# Altium project mini4axis.PrjPcb
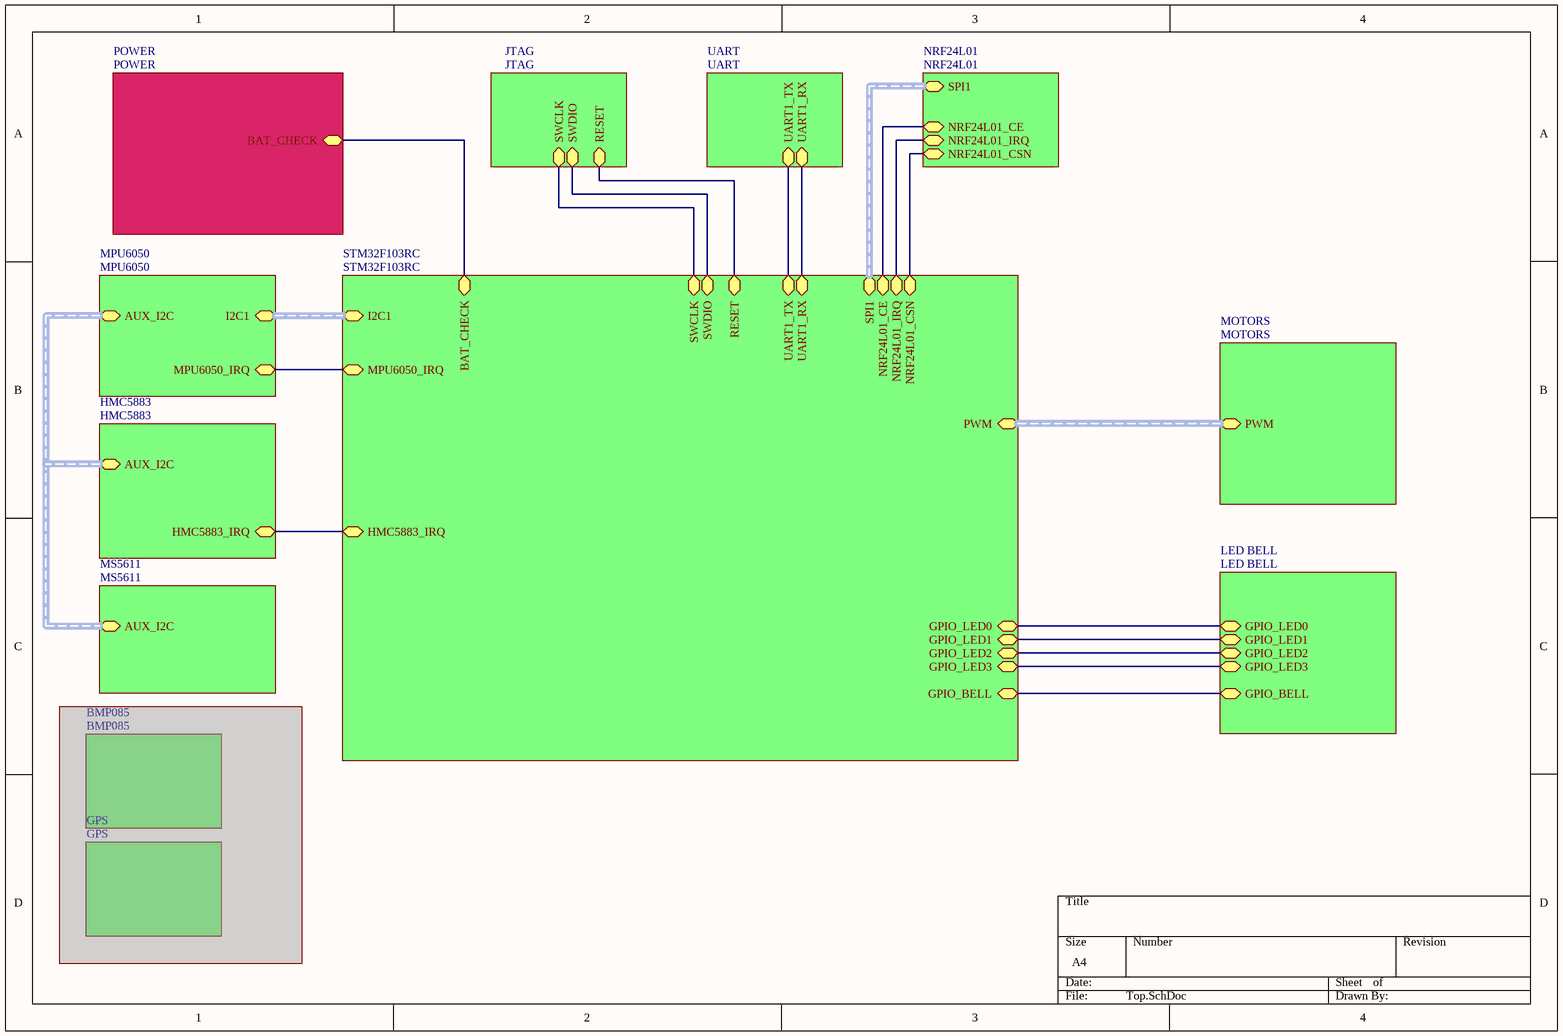
[diagram p0: Top.SchDoc]
11 sheets, 100 parts. Net scope: hierarchical (ports join the sheet entries above them; power ports are global).
Board file: PCB4.PcbDoc
Sheets:
  Top.SchDoc
    POWER = POWER.SchDoc
    JTAG = JTAG.SchDoc
    UART = UART.SchDoc
    NRF24L01 = NRF24L01.SchDoc
    MOTORS = MOTORS.SchDoc
    LED BELL = LED BELL.SchDoc
    MPU6050 = MPU6050.SchDoc
    STM32F103RC = STM32F103RC.SchDoc
    HMC5883 = HMC5883.SchDoc
    MS5611 = MS5611.SchDoc

## Sheet Top.SchDoc: TRACE TRACK
size A4; Author: YZ

### Sub-sheets
BMP085 = BMP085 (masked out) (file not in this document): no entries
GPS = GPS (masked out) (file not in this document): no entries
HMC5883 = HMC5883: AUX_I2C (harness AUX_I2C), HMC5883_IRQ
JTAG = JTAG: SWCLK, SWDIO, RESET
LED BELL = LED BELL: GPIO_LED1, GPIO_LED0, GPIO_BELL, GPIO_LED3, GPIO_LED2
MOTORS = MOTORS: PWM (harness PWM)
MPU6050 = MPU6050: MPU6050_IRQ, I2C1 (harness I2C1), AUX_I2C (harness AUX_I2C)
MS5611 = MS5611: AUX_I2C (harness AUX_I2C)
NRF24L01 = NRF24L01: SPI1 (harness SPI1), NRF24L01_IRQ, NRF24L01_CSN, NRF24L01_CE
POWER = POWER: BAT_CHECK
STM32F103RC = STM32F103RC: UART1_TX, UART1_RX, SWCLK, RESET, SWDIO, GPIO_BELL, GPIO_LED0, GPIO_LED1, PWM (harness PWM), NRF24L01_IRQ, NRF24L01_CSN, SPI1 (harness SPI1), NRF24L01_CE, I2C1 (harness I2C1), MPU6050_IRQ, HMC5883_IRQ, BAT_CHECK, GPIO_LED2, GPIO_LED3
UART = UART: UART1_TX, UART1_RX

### Nets
BAT_CHECK: sheet POWER/BAT_CHECK, sheet STM32F103RC/BAT_CHECK
GPIO_BELL: sheet LED BELL/GPIO_BELL, sheet STM32F103RC/GPIO_BELL
GPIO_LED0: sheet LED BELL/GPIO_LED0, sheet STM32F103RC/GPIO_LED0
GPIO_LED1: sheet LED BELL/GPIO_LED1, sheet STM32F103RC/GPIO_LED1
GPIO_LED2: sheet LED BELL/GPIO_LED2, sheet STM32F103RC/GPIO_LED2
GPIO_LED3: sheet LED BELL/GPIO_LED3, sheet STM32F103RC/GPIO_LED3
HMC5883_IRQ: sheet STM32F103RC/HMC5883_IRQ, sheet HMC5883/HMC5883_IRQ
MPU6050_IRQ: sheet MPU6050/MPU6050_IRQ, sheet STM32F103RC/MPU6050_IRQ
NRF24L01_CE: sheet NRF24L01/NRF24L01_CE, sheet STM32F103RC/NRF24L01_CE
NRF24L01_CSN: sheet NRF24L01/NRF24L01_CSN, sheet STM32F103RC/NRF24L01_CSN
NRF24L01_IRQ: sheet NRF24L01/NRF24L01_IRQ, sheet STM32F103RC/NRF24L01_IRQ
RESET: sheet JTAG/RESET, sheet STM32F103RC/RESET
SWCLK: sheet JTAG/SWCLK, sheet STM32F103RC/SWCLK
SWDIO: sheet JTAG/SWDIO, sheet STM32F103RC/SWDIO
UART1_RX: sheet UART/UART1_RX, sheet STM32F103RC/UART1_RX
UART1_TX: sheet UART/UART1_TX, sheet STM32F103RC/UART1_TX

### Buses and harness runs
harness sheet HMC5883/AUX_I2C = sheet MPU6050/AUX_I2C = sheet MS5611/AUX_I2C
harness sheet MOTORS/PWM = sheet STM32F103RC/PWM
harness sheet MPU6050/I2C1 = sheet STM32F103RC/I2C1
harness sheet NRF24L01/SPI1 = sheet STM32F103RC/SPI1

## Sheet POWER.SchDoc
size A4
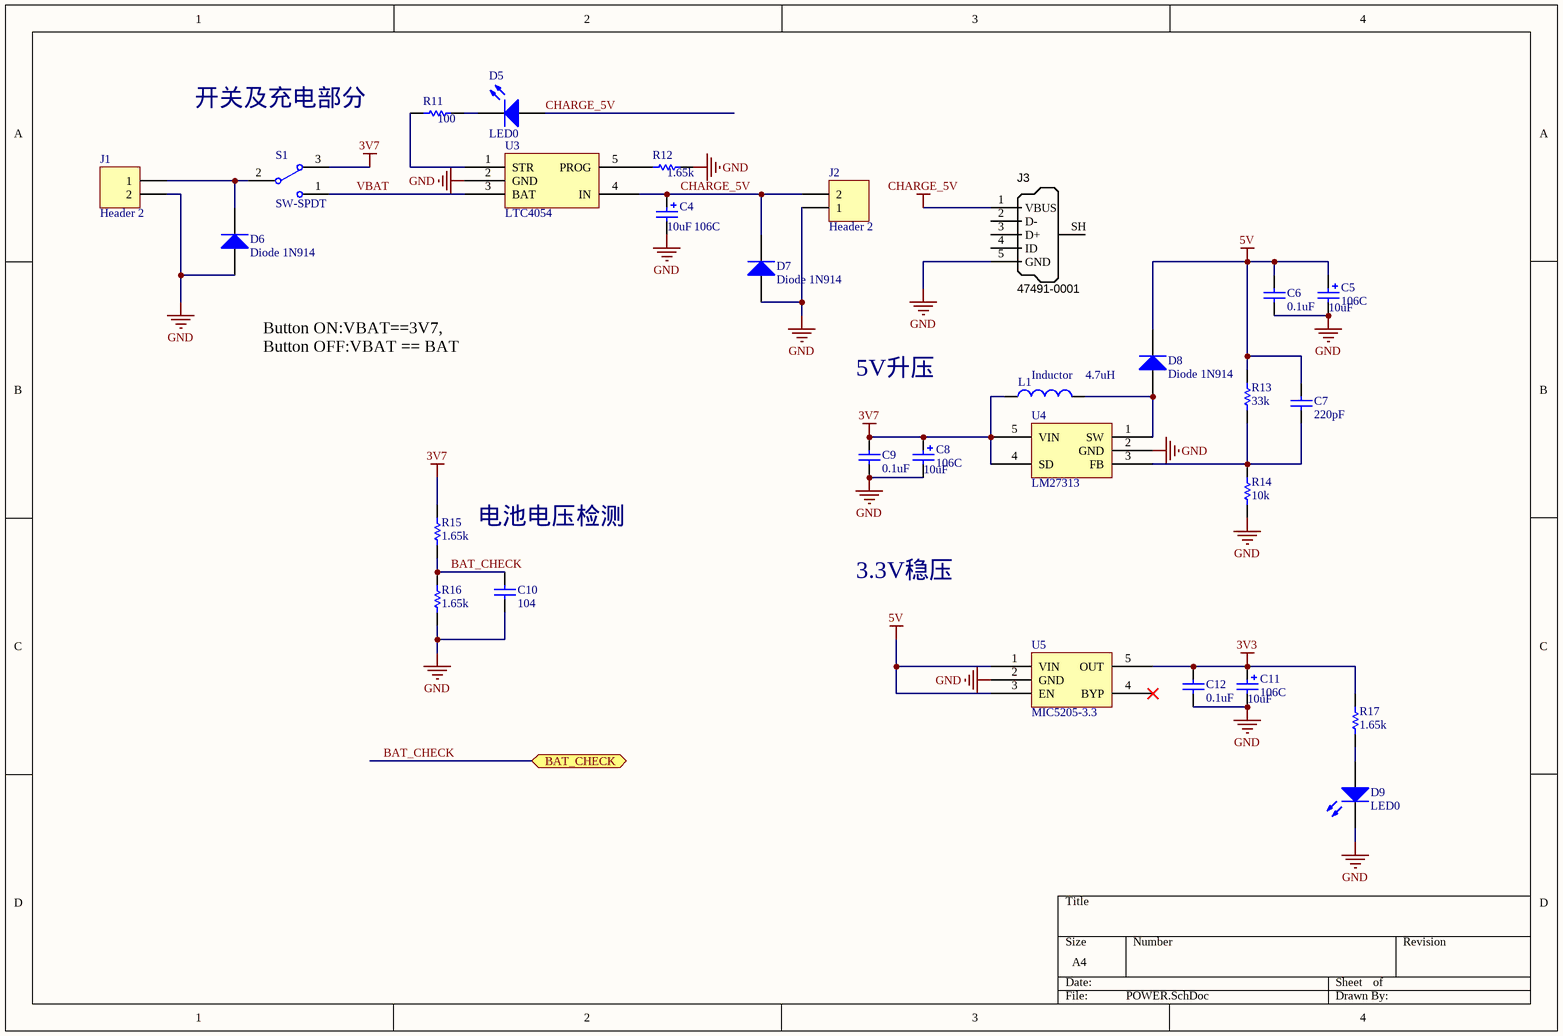
[diagram p1: POWER.SchDoc]

### Parts
(Parts that share a designator on the sheet are numbered #1, #2 ... from top to bottom, then left to right.)
C4  106C  value 10uF  [CAP_TAN_A1206]
C5  106C  value 10uF  [CAP_TAN_A1206]
C6  value 0.1uF  [CAP_0603]  (hidden comment: Cap)
C7  value 220pF  [CAP_0603]  (hidden comment: Cap)
C8  106C  value 10uF  [CAP_TAN_A1206]
C9#1  value 0.1uF  [CAP_0603]  (hidden comment: Cap)
C10#1  value 104  [CAP_0603]  (hidden comment: Cap)
C11#1  106C  value 10uF  [CAP_TAN_A1206]
C12  value 0.1uF  [CAP_0603]  (hidden comment: Cap)
D5  LED0  [LED_0603_RED]
D6  Diode 1N914  [SS14]
D7  Diode 1N914  [SS14]
D8  Diode 1N914  [SS14]
D9  LED0  [LED_0603_RED]
J1  Header 2  [HDR1X2]
J2  Header 2  [HDR1X2]
J3  Manufacturer Part Number 1: 47491-0001  [USB_MICRO_B]  (hidden comment: USB Micro Type B)
L1  Inductor  value 4.7uH  [IND_0805]
R11  value 100  [RES_0603]  (hidden comment: Res Semi)
R12  value 1.65k  [RES_0603]  (hidden comment: Res Semi)
R13  value 33k  [RES_0603]  (hidden comment: Res Semi)
R14  value 10k  [RES_0603]  (hidden comment: Res Semi)
R15  value 1.65k  [RES_0603]  (hidden comment: Res Semi)
R16  value 1.65k  [RES_0603]  (hidden comment: Res Semi)
R17  value 1.65k  [RES_0603]  (hidden comment: Res Semi)
S1  SW-SPDT  [SW_SPDT1X3_180_xx]
U3#1  LTC4054  [SOT23-5]
U4  LM27313  [SOT23-5]
U5  MIC5205-3.3  [SOT23-5]

### Ports
BAT_CHECK

### Nets
3V3: C11#1.1 C12.2 R17.2 U5.5(OUT)
3V7: C8.1 C9#1.2 L1.1 R15.2 S1.3 U4.4(SD) U4.5(VIN)
5V: C5.1 C6.2 C7.2 D8.2(K) R13.2 U5.1(VIN) U5.3(EN)
CHARGE_5V: C4.1 D5.1(A) D7.2(K) J2.2 J3.1(VBUS) U3#1.4(IN)
GND: C4.2 C5.2 C6.1 C8.2 C9#1.1 C10#1.1 C11#1.2 C12.1 D6.1(A) D7.1(A) D9.2(K) J1.2 J2.1 J3.5(GND) R12.2 R14.1 R16.1 U3#1.2(GND) U4.2(GND) U5.2(GND)
BAT_CHECK: C10#1.2 R15.1 R16.2 ; port BAT_CHECK
VBAT: S1.1 U3#1.3(BAT)
NetC7_1: C7.1 R13.1 R14.2 U4.3(FB)
NetD5_2: D5.2(K) R11.2
NetD6_2: D6.2(K) J1.1 S1.2
NetD8_1: D8.1(A) L1.2 U4.1(SW)
NetD9_1: D9.1(A) R17.1
NetR11_1: R11.1 U3#1.1(STR)
NetR12_1: R12.1 U3#1.5(PROG)

Not connected (* = marked no-connect by the designer): J3 2(D-) 3(D+) 4(ID) SH(Shell); U5 4(BYP)*

### Notes on the sheet
- 开关及充电部分
- Button ON:VBAT==3V7,
  Button OFF:VBAT == BAT
- 5V升压
- 电池电压检测
- 3.3V稳压

### Library data of the parts
C4 C5 C8 C11#1 = Cap Pol2: Polarized Capacitor (Axial); Published: 8-Jun-2000; LatestRevisionDate: 17-Jul-2002; LatestRevisionNote: Re-released for DXP Platform.; PackageReference: POLAR0.8; Publisher: Altium Limited; PackageDescription: Polarized Capacitor; 2 Leads
C6 C7 C9#1 C10#1 C12 = Cap: Capacitor; Published: 8-Jun-2000; LatestRevisionDate: 17-Jul-2002; LatestRevisionNote: Re-released for DXP Platform.; PackageReference: RAD-0.3; Publisher: Altium Limited; PackageDescription: Radial Cap, Thru-Hole; 2 Leads; 0.3 in Pin Spacing
D5 D9 = LED0: Typical INFRARED GaAs LED; Published: 8-Jun-2000; LatestRevisionDate: 08-Jul-2005; LatestRevisionNote: Mech Layer 1 removed.; PackageReference: LED-0; Publisher: Altium Limited; PackageDescription: LED; 2 Leads
D6-D8 = Diode 1N914: High Conductance Fast Diode; Published: 8-Jun-2000; LatestRevisionDate: 17-Jul-2002; LatestRevisionNote: Re-released for DXP Platform.; DatasheetVersion: 1997; PackageReference: DO-35; Publisher: Altium Limited; PackageDescription: Diode, Axial; Body 3.8 x 1.9 mm (LxDia. max), Lead Dia. 0.53 mm (max); Code_JEDEC: DO-204-AH; ComponentLink1Description: Manufacturer Link; ComponentLink1URL: http://www.fairchildsemi.com/; ComponentLink2Description: Datasheet; ComponentLink2URL: http://www.fairchildsemi.com/ds/1N%2F1N4448.pdf
J1 J2 = Header 2: Header, 2-Pin; LatestRevisionDate: 17-Jul-2002; LatestRevisionNote: Re-released for DXP Platform.; Publisher: Altium Limited
J3 = USB_Micro_TypeB: Connector SMD USB Micro Type B middle mount; Manufacturer 1: Molex Inc; Package / Case: SMD; Supplier 1: Digi-Key; Supplier Part Number 1: WM17142CT-ND
L1 = Inductor: Code_IEC: 1005; Published: 8-Jun-2000; LatestRevisionDate: 29-May-2009; LatestRevisionNote: IPC-7351 Footprint Added.; PackageReference: 0402-A; Publisher: Altium Limited; PackageDescription: Chip Inductor; Code_JEITA: 0402
R11-R17 = Res Semi: Semiconductor Resistor; Published: 8-Jun-2000; LatestRevisionDate: 17-Jul-2002; LatestRevisionNote: Re-released for DXP Platform.; PackageReference: AXIAL-0.5; Publisher: Altium Limited; PackageDescription: Axial Device, Thru-Hole; 2 Leads; 0.5 in Pin Spacing
S1 = SW-SPDT: SPDT Subminiature Toggle Switch, Right Angle Mounting, Vertical Actuation; Published: 24-Mar-1999; LatestRevisionDate: 17-Dec-2003; LatestRevisionNote: Schematic revised, PCB Footprint replaced.; DatasheetVersion: 05-Dec-2000; PackageReference: TL36WW15050; Publisher: Altium Limited; PackageDescription: Switch; 4 Leads; ComponentLink1Description: Manufacturer Link; ComponentLink1URL: http://www.apem.com

## Sheet JTAG.SchDoc
size A4
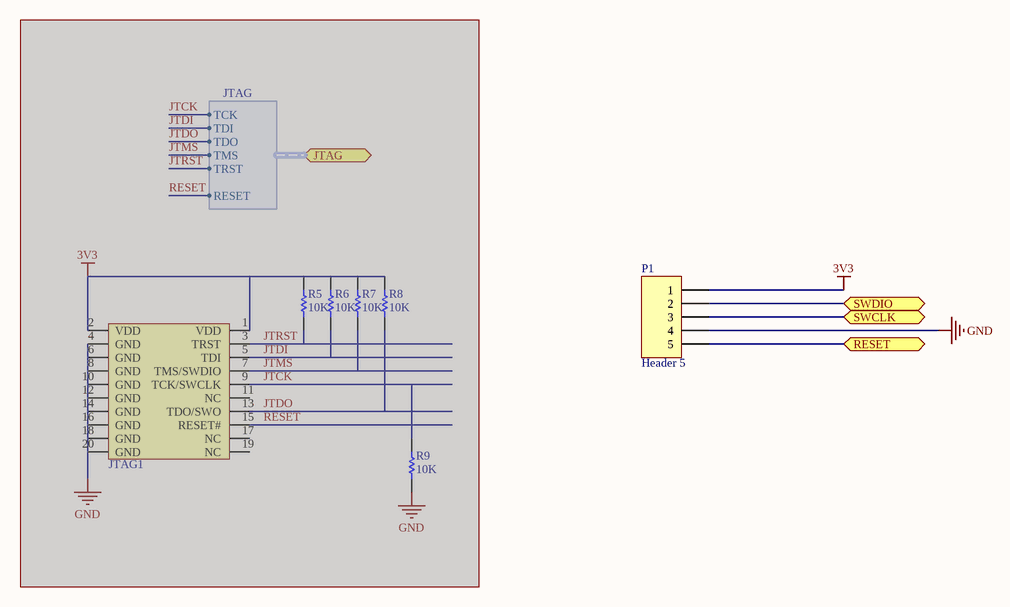
[diagram p2: JTAG.SchDoc]

### Parts
(Parts that share a designator on the sheet are numbered #1, #2 ... from top to bottom, then left to right.)
JTAG1  JTAG  [JTAG_20]  (value not drawn)  (masked out: inside a compile mask, not in the netlist)
P1  Header 5  [HDR1X5]
R5#1  value 10K  [RES_0603]  (hidden comment: Res1)  (masked out: inside a compile mask, not in the netlist)
R6#1  value 10K  [RES_0603]  (hidden comment: Res1)  (masked out: inside a compile mask, not in the netlist)
R7#1  value 10K  [RES_0603]  (hidden comment: Res1)  (masked out: inside a compile mask, not in the netlist)
R8#1  value 10K  [RES_0603]  (hidden comment: Res1)  (masked out: inside a compile mask, not in the netlist)
R9#1  value 10K  [RES_0603]  (hidden comment: Res1)  (masked out: inside a compile mask, not in the netlist)

### Ports
JTAG (harness JTAG), RESET, SWCLK, SWDIO

### Harnesses
JTAG: TCK, TDI, TDO, TMS, TRST, RESET

### Nets
3V3: P1.1
GND: P1.4
RESET: P1.5 ; port RESET
SWCLK: P1.3 ; port SWCLK
SWDIO: P1.2 ; port SWDIO

### Library data of the parts
P1 = Header 5: Header, 5-Pin; LatestRevisionDate: 17-Jul-2002; LatestRevisionNote: Re-released for DXP Platform.; Publisher: Altium Limited
R5#1 R6#1 R7#1 R8#1 R9#1 = Res1: Resistor; Published: 8-Jun-2000; LatestRevisionDate: 17-Jul-2002; LatestRevisionNote: Re-released for DXP Platform.; PackageReference: AXIAL-0.3; Publisher: Altium Limited; PackageDescription: Axial Device, Thru-Hole; 2 Leads; 0.3 in Pin Spacing

## Sheet UART.SchDoc
size A4
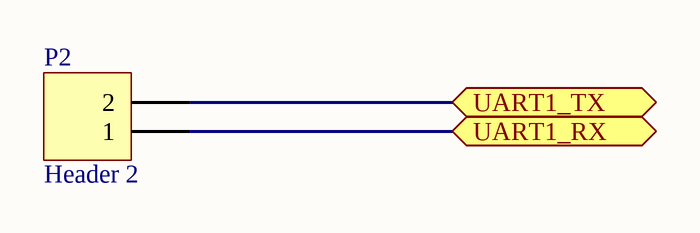
[diagram p3: UART.SchDoc]

### Parts
P2  Header 2  [HDR1X2]

### Ports
UART1_RX, UART1_TX

### Nets
UART1_RX: P2.1 ; port UART1_RX
UART1_TX: P2.2 ; port UART1_TX

### Library data of the parts
P2 = Header 2: Header, 2-Pin; LatestRevisionDate: 17-Jul-2002; LatestRevisionNote: Re-released for DXP Platform.; Publisher: Altium Limited

## Sheet NRF24L01.SchDoc
size A4
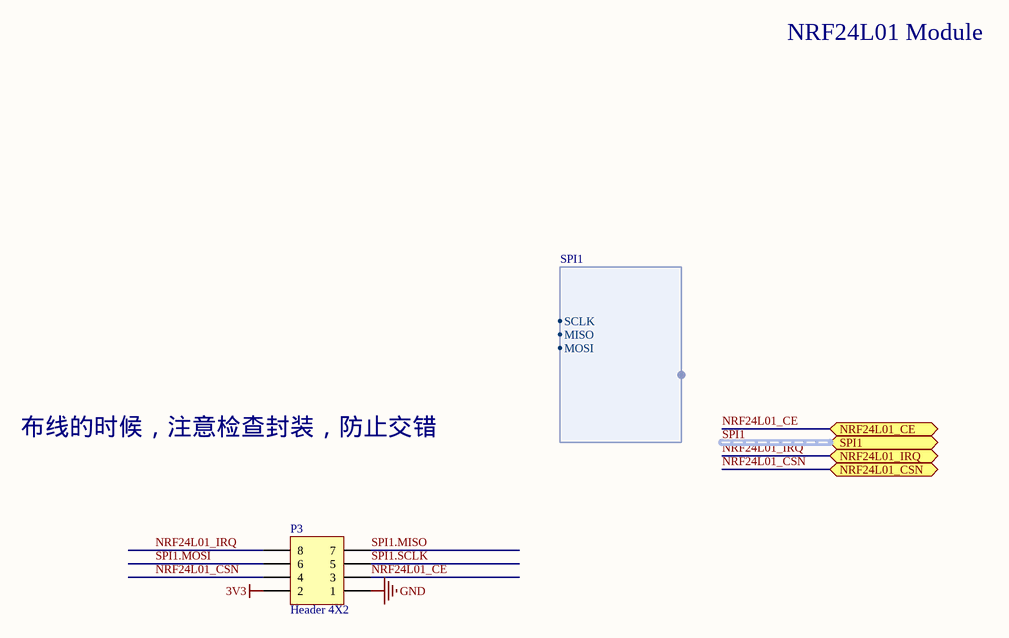
[diagram p4: NRF24L01.SchDoc]

### Parts
P3  Header 4X2  [NRF24L01 MODULE]

### Ports
NRF24L01_CE, NRF24L01_CSN, NRF24L01_IRQ, SPI1 (harness SPI1)

### Harnesses
SPI1: SCLK, MISO, MOSI

### Nets
3V3: P3.2
GND: P3.1
NRF24L01_CE: P3.3 ; port NRF24L01_CE
NRF24L01_CSN: P3.4 ; port NRF24L01_CSN
NRF24L01_IRQ: P3.8 ; port NRF24L01_IRQ
SPI1.MISO: P3.7
SPI1.MOSI: P3.6
SPI1.SCLK: P3.5

### Buses and harness runs
harness SPI1 = port SPI1

### Notes on the sheet
- NRF24L01 Module
- 布线的时候，注意检查封装，防止交错

### Library data of the parts
P3 = Header 4X2: Header, 4-Pin, Dual row; LatestRevisionDate: 17-Jul-2002; LatestRevisionNote: Re-released for DXP Platform.; Publisher: Altium Limited

## Sheet MOTORS.SchDoc
size A4
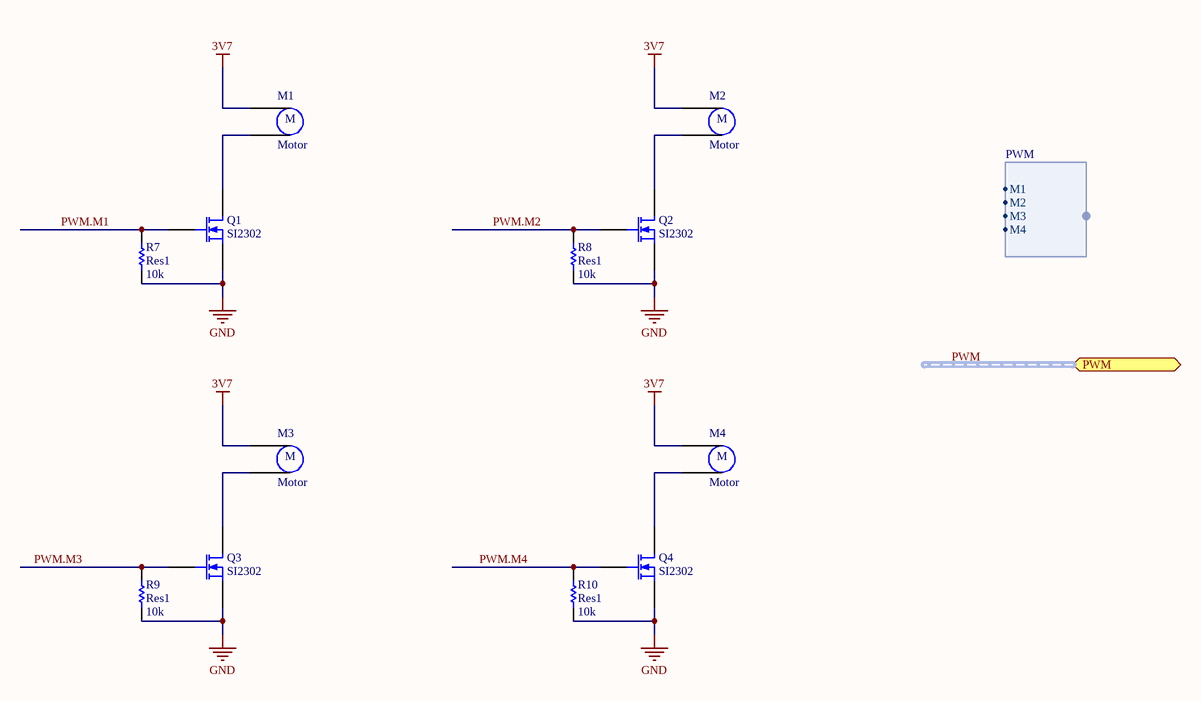
[diagram p5: MOTORS.SchDoc]

### Parts
(Parts that share a designator on the sheet are numbered #1, #2 ... from top to bottom, then left to right.)
M1  Motor  [HDR1X2_180_2.54]
M2  Motor  [HDR1X2_180_2.54]
M3  Motor  [HDR1X2_180_2.54]
M4  Motor  [HDR1X2_180_2.54]
Q1  SI2302  [SOT23]
Q2  SI2302  [SOT23]
Q3  SI2302  [SOT23]
Q4  SI2302  [SOT23]
R7#2  Res1  value 10k  [RES_0603]
R8#2  Res1  value 10k  [RES_0603]
R9#2  Res1  value 10k  [RES_0603]
R10  Res1  value 10k  [RES_0603]

### Ports
PWM (harness PWM)

### Harnesses
PWM: M1, M2, M3, M4

### Nets
3V7: M1.1 M2.1 M3.1 M4.1
GND: Q1.2(S) Q2.2(S) Q3.2(S) Q4.2(S) R7#2.1 R8#2.1 R9#2.1 R10.1
PWM.M1: Q1.1(G) R7#2.2
PWM.M2: Q2.1(G) R8#2.2
PWM.M3: Q3.1(G) R9#2.2
PWM.M4: Q4.1(G) R10.2
NetM1_2: M1.2 Q1.3(D)
NetM2_2: M2.2 Q2.3(D)
NetM3_2: M3.2 Q3.3(D)
NetM4_2: M4.2 Q4.3(D)

### Buses and harness runs
harness PWM = port PWM

### Notes on the sheet
- (in symbol Motor) M

### Library data of the parts
Q1-Q4 = SI2302: N-Channel MOSFET; Published: 8-Jun-2000; LatestRevisionDate: 17-Jul-2002; LatestRevisionNote: Re-released for DXP Platform.; PackageVersion: 1995/1996; PackageReference: E3; Publisher: Altium Limited; PackageDescription: TO, Flat Index; 3 In-Line, Axial Leads; Body Dia. 4.6mm; Lead Dia. 0.5 mm (max)
R7#2 R8#2 R9#2 R10 = Res1: Resistor; Published: 8-Jun-2000; LatestRevisionDate: 17-Jul-2002; LatestRevisionNote: Re-released for DXP Platform.; PackageReference: AXIAL-0.3; Publisher: Altium Limited; PackageDescription: Axial Device, Thru-Hole; 2 Leads; 0.3 in Pin Spacing

## Sheet LED BELL.SchDoc
size A4
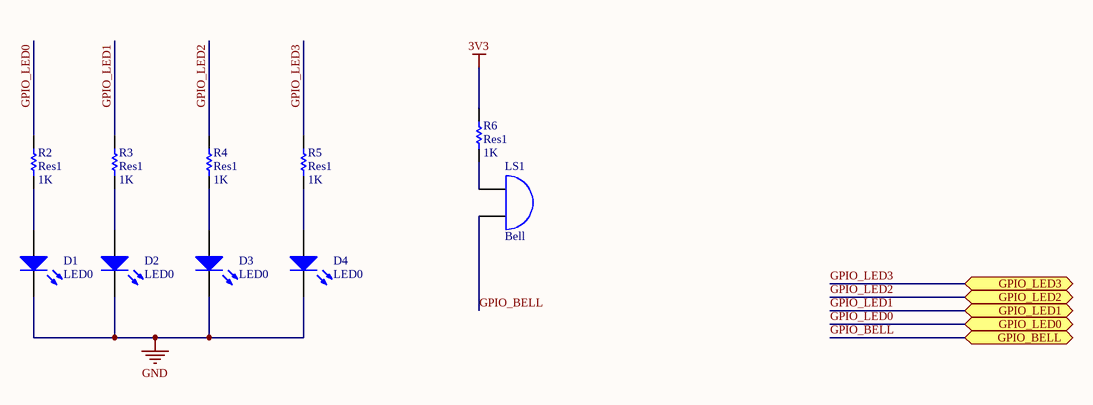
[diagram p6: LED BELL.SchDoc]

### Parts
(Parts that share a designator on the sheet are numbered #1, #2 ... from top to bottom, then left to right.)
D1  LED0  [LED_0603_BLUE]
D2  LED0  [LED_0603_BLUE]
D3  LED0  [LED_0603_GREEN]
D4  LED0  [LED_0603_GREEN]
LS1  Bell  [LED0805]
R2#1  Res1  value 1K  [RES_0603]
R3#1  Res1  value 1K  [RES_0603]
R4#1  Res1  value 1K  [RES_0603]
R5#2  Res1  value 1K  [RES_0603]
R6#2  Res1  value 1K  [RES_0603]

### Ports
GPIO_BELL, GPIO_LED0, GPIO_LED1, GPIO_LED2, GPIO_LED3

### Nets
3V3: R6#2.2
GND: D1.2(K) D2.2(K) D3.2(K) D4.2(K)
GPIO_BELL: LS1.2(B) ; port GPIO_BELL
GPIO_LED0: R2#1.2 ; port GPIO_LED0
GPIO_LED1: R3#1.2 ; port GPIO_LED1
GPIO_LED2: R4#1.2 ; port GPIO_LED2
GPIO_LED3: R5#2.2 ; port GPIO_LED3
NetD1_1: D1.1(A) R2#1.1
NetD2_1: D2.1(A) R3#1.1
NetD3_1: D3.1(A) R4#1.1
NetD4_1: D4.1(A) R5#2.1
NetLS1_1: LS1.1(A) R6#2.1

### Library data of the parts
D1-D4 = LED0: Typical INFRARED GaAs LED; Published: 8-Jun-2000; LatestRevisionDate: 08-Jul-2005; LatestRevisionNote: Mech Layer 1 removed.; PackageReference: LED-0; Publisher: Altium Limited; PackageDescription: LED; 2 Leads
LS1 = Bell: Electrical Bell; Published: 24-Mar-1999; LatestRevisionDate: 17-Jul-2002; LatestRevisionNote: Re-released for DXP Platform.; PackageReference: PIN2; Publisher: Altium Limited
R2#1 R3#1 R4#1 R5#2 R6#2 = Res1: Resistor; Published: 8-Jun-2000; LatestRevisionDate: 17-Jul-2002; LatestRevisionNote: Re-released for DXP Platform.; PackageReference: AXIAL-0.3; Publisher: Altium Limited; PackageDescription: Axial Device, Thru-Hole; 2 Leads; 0.3 in Pin Spacing

## Sheet MPU6050.SchDoc
size A4
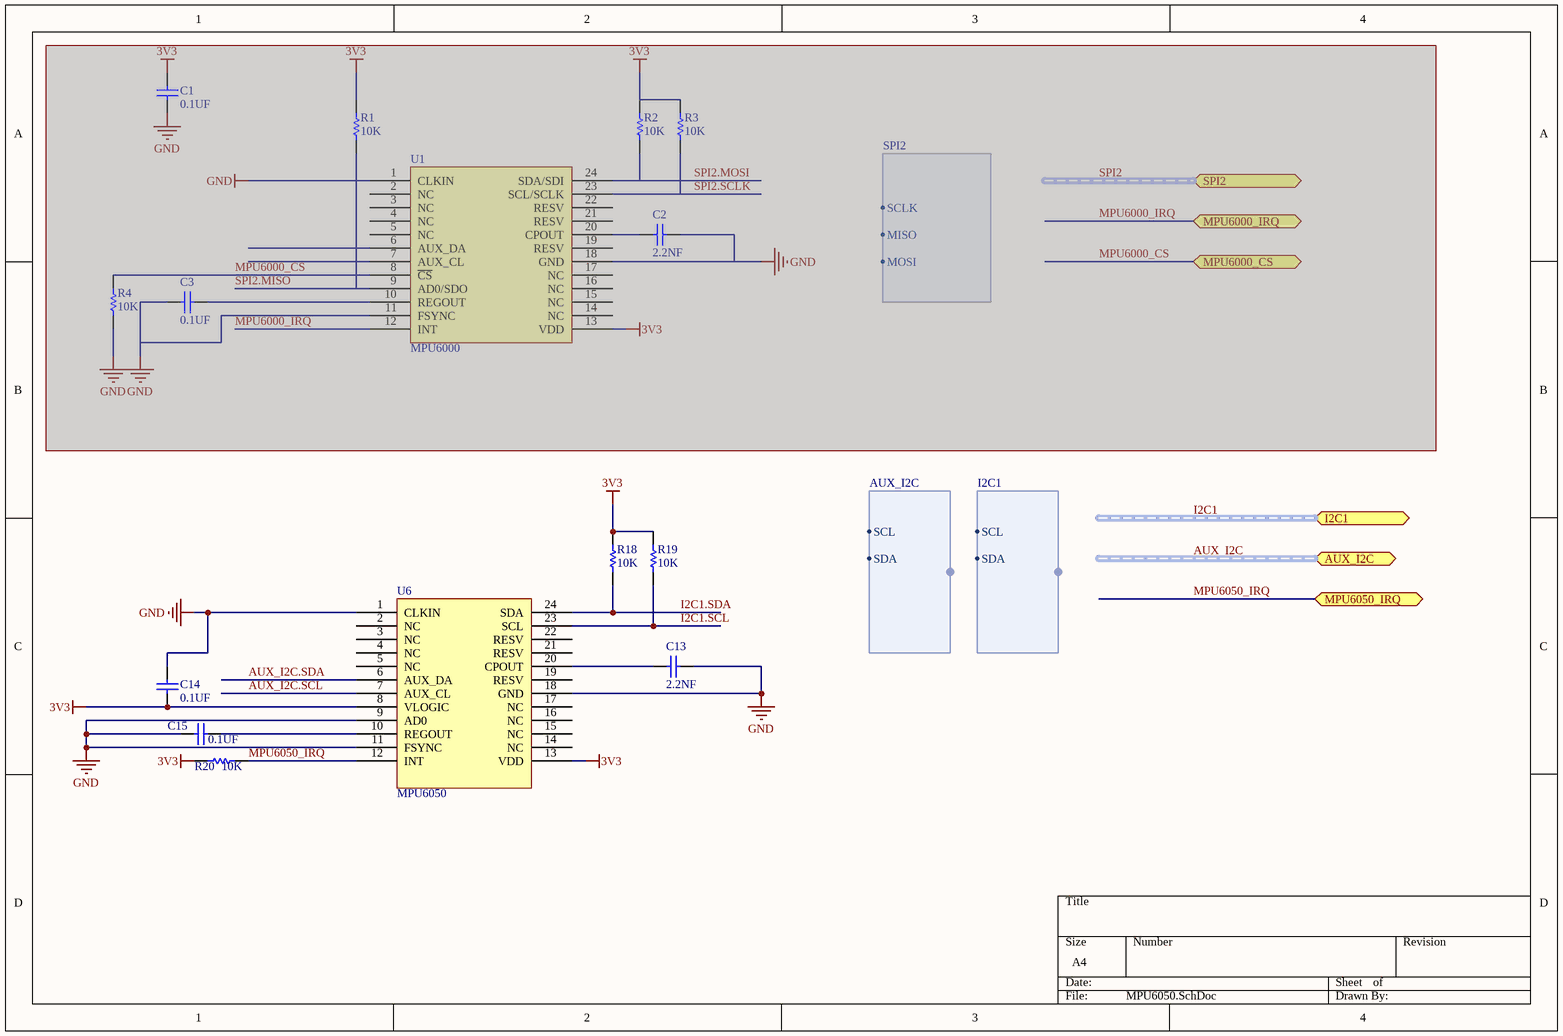
[diagram p7: MPU6050.SchDoc]

### Parts
(Parts that share a designator on the sheet are numbered #1, #2 ... from top to bottom, then left to right.)
C1#1  value 0.1UF  [CAP_0603]  (hidden comment: Cap)  (masked out: inside a compile mask, not in the netlist)
C2#1  value 2.2NF  [CAP_0603]  (hidden comment: Cap)  (masked out: inside a compile mask, not in the netlist)
C3#1  value 0.1UF  [CAP_0603]  (hidden comment: Cap)  (masked out: inside a compile mask, not in the netlist)
C13  value 2.2NF  [CAP_0603]  (hidden comment: Cap)
C14  value 0.1UF  [CAP_0603]  (hidden comment: Cap)
C15  value 0.1UF  [CAP_0603]  (hidden comment: Cap)
R1#1  value 10K  [RC0805]  (hidden comment: Res1)  (masked out: inside a compile mask, not in the netlist)
R2#2  value 10K  [RC0805]  (hidden comment: Res1)  (masked out: inside a compile mask, not in the netlist)
R3#2  value 10K  [RC0805]  (hidden comment: Res1)  (masked out: inside a compile mask, not in the netlist)
R4#2  value 10K  [RC0805]  (hidden comment: Res1)  (masked out: inside a compile mask, not in the netlist)
R18  value 10K  [RES_0603]  (hidden comment: Res1)
R19  value 10K  [RES_0603]  (hidden comment: Res1)
R20  value 10K  [RES_0603]  (hidden comment: Res1)
U1#1  MPU6000  [QFN24_M]  (masked out: inside a compile mask, not in the netlist)
U6  MPU6050  [MPU60X0_QFN24]

### Ports
AUX_I2C (harness AUX_I2C), I2C1 (harness I2C1), MPU6000_CS, MPU6000_IRQ, MPU6050_IRQ, SPI2 (harness SPI2)

### Harnesses
SPI2: SCLK, MISO, MOSI
I2C1: SCL, SDA
AUX_I2C: SCL, SDA

### Nets
3V3: C14.1 R18.1 R19.1 R20.1 U6.8(VLOGIC) U6.13(VDD)
GND: C13.2 C14.2 C15.1 U6.1(CLKIN) U6.9(AD0) U6.11(FSYNC) U6.18(GND)
AUX_I2C.SCL: U6.7(AUX_CL)
AUX_I2C.SDA: U6.6(AUX_DA)
I2C1.SCL: R19.2 U6.23(SCL)
I2C1.SDA: R18.2 U6.24(SDA)
MPU6050_IRQ: R20.2 U6.12(INT) ; port MPU6050_IRQ
NetC13_1: C13.1 U6.20(CPOUT)
NetC15_2: C15.2 U6.10(REGOUT)

Not connected (* = marked no-connect by the designer): U6 2(NC) 3(NC) 4(NC) 5(NC) 14(NC) 15(NC) 16(NC) 17(NC) 19(RESV) 21(RESV) 22(RESV)

### Buses and harness runs
harness AUX_I2C = port AUX_I2C
harness I2C1 = port I2C1

### Library data of the parts
C1#1 C2#1 C3#1 C13-C15 = Cap: Capacitor; Published: 8-Jun-2000; LatestRevisionDate: 17-Jul-2002; LatestRevisionNote: Re-released for DXP Platform.; PackageReference: RAD-0.3; Publisher: Altium Limited; PackageDescription: Radial Cap, Thru-Hole; 2 Leads; 0.3 in Pin Spacing
R1#1 R2#2 R3#2 R4#2 R18-R20 = Res1: Resistor; Published: 8-Jun-2000; LatestRevisionDate: 17-Jul-2002; LatestRevisionNote: Re-released for DXP Platform.; PackageReference: AXIAL-0.3; Publisher: Altium Limited; PackageDescription: Axial Device, Thru-Hole; 2 Leads; 0.3 in Pin Spacing

## Sheet STM32F103RC.SchDoc
size A4
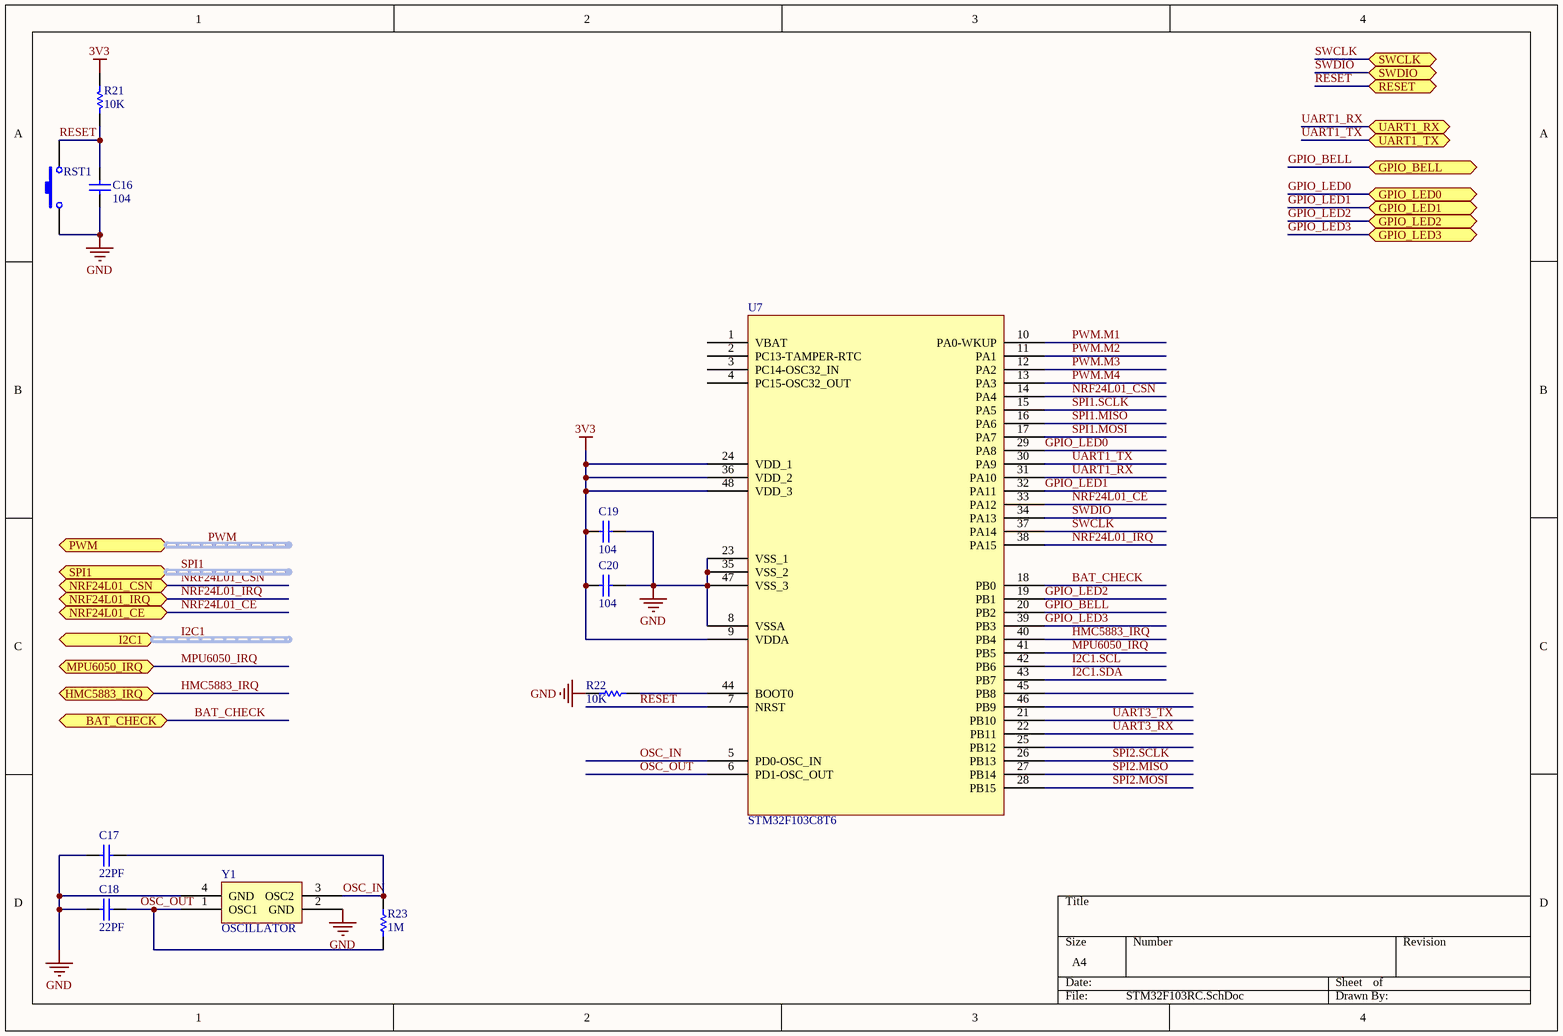
[diagram p8: STM32F103RC.SchDoc]

### Parts
C16  value 104  [CAP_0603]  (hidden comment: Cap)
C17  value 22PF  [CAP_0603]  (hidden comment: Cap)
C18  value 22PF  [CAP_0603]  (hidden comment: Cap)
C19  value 104  [CAP_0603]  (hidden comment: Cap)
C20  value 104  [CAP_0603]  (hidden comment: Cap)
R21  value 10K  [RES_0603]  (hidden comment: Res1)
R22  value 10K  [RES_0603]  (hidden comment: Res1)
R23  value 1M  [RES_0603]  (hidden comment: Res1)
RST1  SW-PB  [KEY]  (value not drawn)
U7  STM32F103C8T6  [TQFP_48]
Y1  OSCILLATOR  [3225]

### Ports
BAT_CHECK, GPIO_BELL, GPIO_LED0, GPIO_LED1, GPIO_LED2, GPIO_LED3, HMC5883_IRQ, I2C1 (harness I2C1), MPU6050_IRQ, NRF24L01_CE, NRF24L01_CSN, NRF24L01_IRQ, PWM (harness PWM), RESET, SPI1 (harness SPI1), SWCLK, SWDIO, UART1_RX, UART1_TX

### Nets
3V3: C19.1 C20.1 R21.2 U7.9(VDDA) U7.24(VDD_1) U7.36(VDD_2) U7.48(VDD_3)
GND: C16.2 C17.1 C18.1 C19.2 C20.2 R22.1 RST1.2 U7.8(VSSA) U7.23(VSS_1) U7.35(VSS_2) U7.47(VSS_3) Y1.2(GND) Y1.4(GND)
BAT_CHECK: U7.18(PB0) ; port BAT_CHECK
GPIO_BELL: U7.20(PB2) ; port GPIO_BELL
GPIO_LED0: U7.29(PA8) ; port GPIO_LED0
GPIO_LED1: U7.32(PA11) ; port GPIO_LED1
GPIO_LED2: U7.19(PB1) ; port GPIO_LED2
GPIO_LED3: U7.39(PB3) ; port GPIO_LED3
HMC5883_IRQ: U7.40(PB4) ; port HMC5883_IRQ
I2C1.SCL: U7.42(PB6)
I2C1.SDA: U7.43(PB7)
MPU6050_IRQ: U7.41(PB5) ; port MPU6050_IRQ
NRF24L01_CE: U7.33(PA12) ; port NRF24L01_CE
NRF24L01_CSN: U7.14(PA4) ; port NRF24L01_CSN
NRF24L01_IRQ: U7.38(PA15) ; port NRF24L01_IRQ
OSC_IN: C17.2 R23.2 U7.5(PD0-OSC_IN) Y1.3(OSC2)
OSC_OUT: C18.2 R23.1 U7.6(PD1-OSC_OUT) Y1.1(OSC1)
PWM.M1: U7.10(PA0-WKUP)
PWM.M2: U7.11(PA1)
PWM.M3: U7.12(PA2)
PWM.M4: U7.13(PA3)
RESET: C16.1 R21.1 RST1.1 U7.7(NRST) ; port RESET
SPI1.MISO: U7.16(PA6)
SPI1.MOSI: U7.17(PA7)
SPI1.SCLK: U7.15(PA5)
SPI2.MISO: U7.27(PB14)
SPI2.MOSI: U7.28(PB15)
SPI2.SCLK: U7.26(PB13)
SWCLK: U7.37(PA14) ; port SWCLK
SWDIO: U7.34(PA13) ; port SWDIO
UART1_RX: U7.31(PA10) ; port UART1_RX
UART1_TX: U7.30(PA9) ; port UART1_TX
UART3_RX: U7.22(PB11)
UART3_TX: U7.21(PB10)
NetR22_2: R22.2 U7.44(BOOT0)

Not connected (* = marked no-connect by the designer): U7 1(VBAT) 2(PC13-TAMPER-RTC) 3(PC14-OSC32_IN) 4(PC15-OSC32_OUT) 25(PB12) 45(PB8) 46(PB9)

### Buses and harness runs
harness I2C1 = port I2C1
harness PWM = port PWM
harness SPI1 = port SPI1

### Library data of the parts
C16-C20 = Cap: Capacitor; Published: 8-Jun-2000; LatestRevisionDate: 17-Jul-2002; LatestRevisionNote: Re-released for DXP Platform.; PackageReference: RAD-0.3; Publisher: Altium Limited; PackageDescription: Radial Cap, Thru-Hole; 2 Leads; 0.3 in Pin Spacing
R21-R23 = Res1: Resistor; Published: 8-Jun-2000; LatestRevisionDate: 17-Jul-2002; LatestRevisionNote: Re-released for DXP Platform.; PackageReference: AXIAL-0.3; Publisher: Altium Limited; PackageDescription: Axial Device, Thru-Hole; 2 Leads; 0.3 in Pin Spacing
RST1 = SW-PB: Switch; Published: 24-Mar-1999; LatestRevisionDate: 17-Jul-2002; LatestRevisionNote: Re-released for DXP Platform.; PackageReference: SPST-2; Publisher: Altium Limited; PackageDescription: Switch; 2 Leads

## Sheet HMC5883.SchDoc
size A4
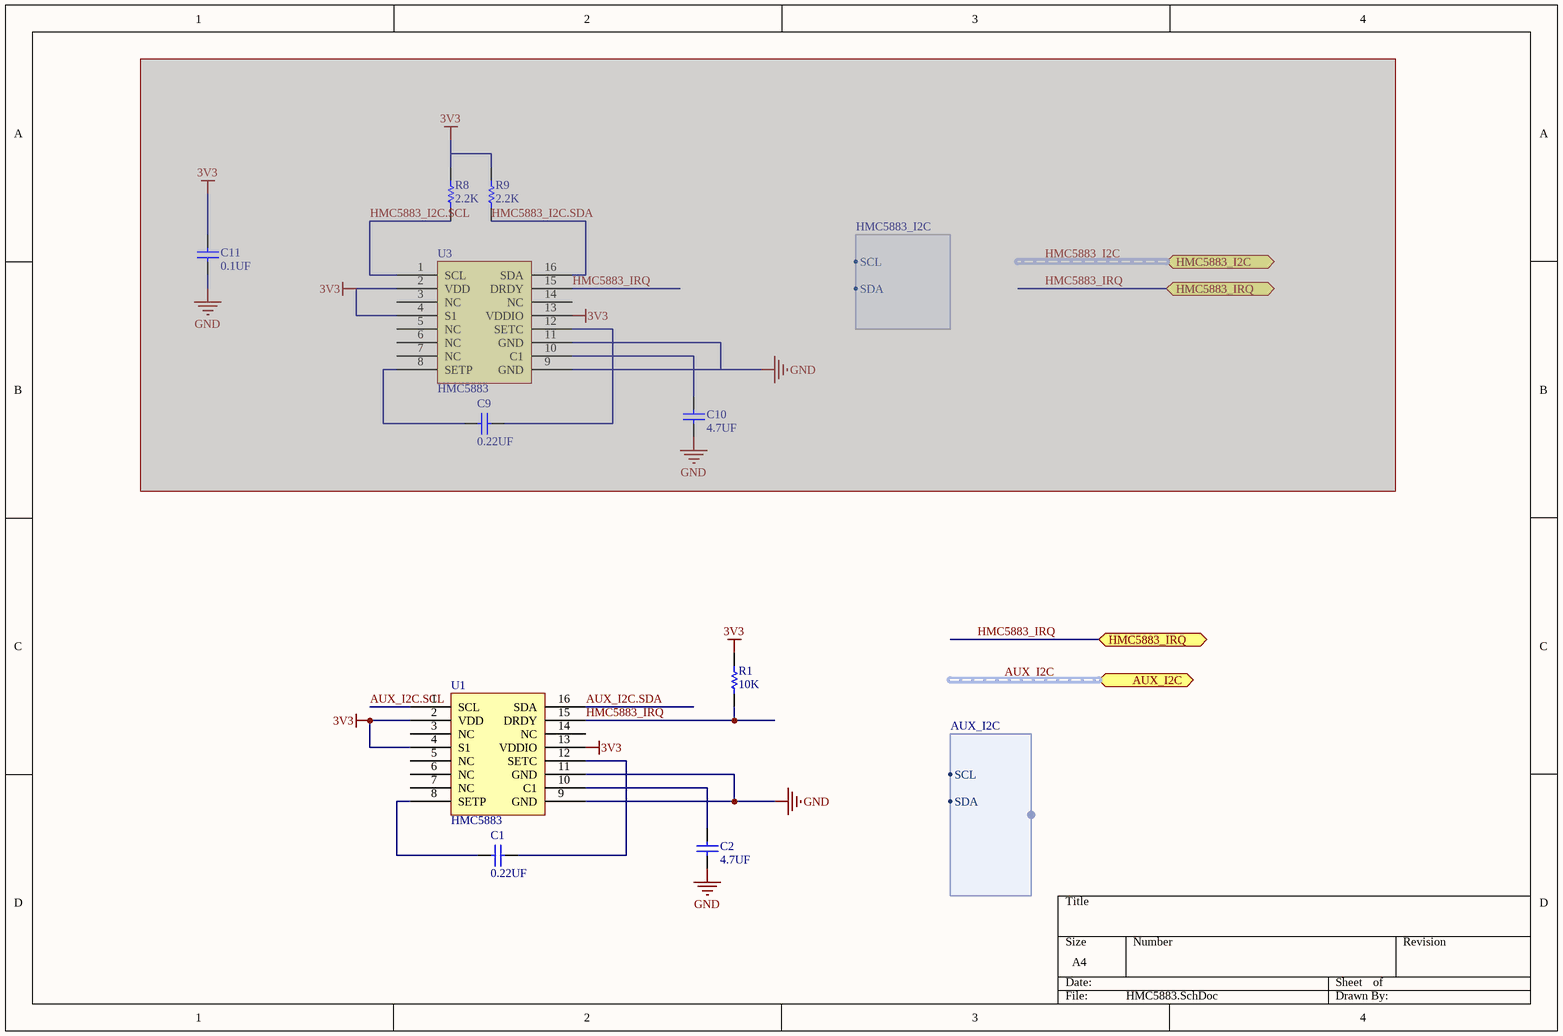
[diagram p9: HMC5883.SchDoc]

### Parts
(Parts that share a designator on the sheet are numbered #1, #2 ... from top to bottom, then left to right.)
C1#2  value 0.22UF  [CAP_0603]  (hidden comment: Cap)
C2#2  value 4.7UF  [CAP_0603]  (hidden comment: Cap)
C9#2  value 0.22UF  [CAP_0603]  (hidden comment: Cap)  (masked out: inside a compile mask, not in the netlist)
C10#2  value 4.7UF  [CAP_0603]  (hidden comment: Cap)  (masked out: inside a compile mask, not in the netlist)
C11#2  value 0.1UF  [CAP_0603]  (hidden comment: Cap)  (masked out: inside a compile mask, not in the netlist)
R1#2  value 10K  [RES_0603]  (hidden comment: Res1)
R8#3  value 2.2K  [RES_0603]  (hidden comment: Res1)  (masked out: inside a compile mask, not in the netlist)
R9#3  value 2.2K  [RES_0603]  (hidden comment: Res1)  (masked out: inside a compile mask, not in the netlist)
U1#2  HMC5883  [HMC5883]
U3#2  HMC5883  (masked out: inside a compile mask, not in the netlist)

### Ports
AUX_I2C (harness AUX_I2C), HMC5883_I2C (harness HMC5883_I2C), HMC5883_IRQ

### Harnesses
HMC5883_I2C: SCL, SDA
AUX_I2C: SCL, SDA

### Nets
3V3: R1#2.1 U1#2.2(VDD) U1#2.4(S1) U1#2.13(VDDIO)
GND: C2#2.1 U1#2.9(GND) U1#2.11(GND)
AUX_I2C.SCL: U1#2.1(SCL)
AUX_I2C.SDA: U1#2.16(SDA)
HMC5883_IRQ: R1#2.2 U1#2.15(DRDY) ; port HMC5883_IRQ
NetC1#2_1: C1#2.1 U1#2.12(SETC)
NetC1#2_2: C1#2.2 U1#2.8(SETP)
NetC2#2_2: C2#2.2 U1#2.10(C1)

Not connected (* = marked no-connect by the designer): U1#2 3(NC) 5(NC) 6(NC) 7(NC) 14(NC)

### Buses and harness runs
harness AUX_I2C = port AUX_I2C

### Library data of the parts
C1#2 C2#2 C9#2 C10#2 C11#2 = Cap: Capacitor; Published: 8-Jun-2000; LatestRevisionDate: 17-Jul-2002; LatestRevisionNote: Re-released for DXP Platform.; PackageReference: RAD-0.3; Publisher: Altium Limited; PackageDescription: Radial Cap, Thru-Hole; 2 Leads; 0.3 in Pin Spacing
R1#2 R8#3 R9#3 = Res1: Resistor; Published: 8-Jun-2000; LatestRevisionDate: 17-Jul-2002; LatestRevisionNote: Re-released for DXP Platform.; PackageReference: AXIAL-0.3; Publisher: Altium Limited; PackageDescription: Axial Device, Thru-Hole; 2 Leads; 0.3 in Pin Spacing

## Sheet MS5611.SchDoc
size A4
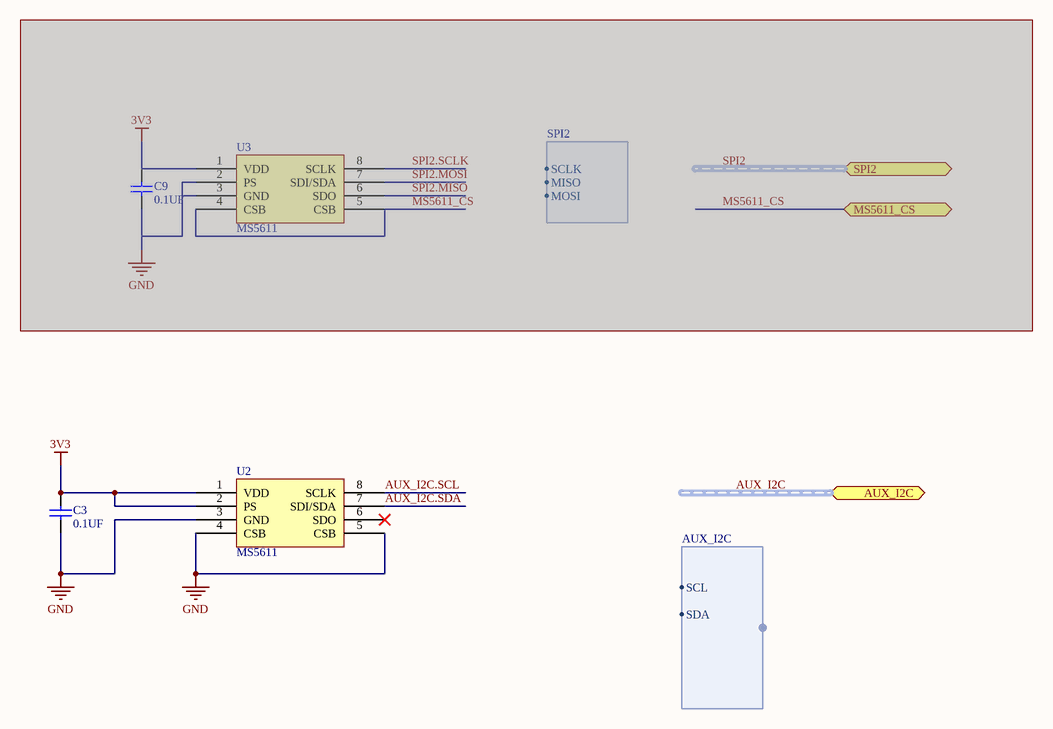
[diagram p10: MS5611.SchDoc]

### Parts
(Parts that share a designator on the sheet are numbered #1, #2 ... from top to bottom, then left to right.)
C3#2  value 0.1UF  [CAP_0603]  (hidden comment: Cap)
C9#3  value 0.1UF  [CAP_0603]  (hidden comment: Cap)  (masked out: inside a compile mask, not in the netlist)
U2  MS5611  [MS5611]
U3#3  MS5611  (masked out: inside a compile mask, not in the netlist)

### Ports
AUX_I2C (harness AUX_I2C), MS5611_CS, SPI2 (harness SPI2)

### Harnesses
SPI2: SCLK, MISO, MOSI
AUX_I2C: SCL, SDA

### Nets
3V3: C3#2.2 U2.1(VDD) U2.2(PS)
GND: C3#2.1 U2.3(GND) U2.4(CSB) U2.5(CSB)
AUX_I2C.SCL: U2.8(SCLK)
AUX_I2C.SDA: U2.7(SDI/SDA)

Not connected (* = marked no-connect by the designer): U2 6(SDO)*

### Buses and harness runs
harness AUX_I2C = port AUX_I2C

### Library data of the parts
C3#2 C9#3 = Cap: Capacitor; Published: 8-Jun-2000; LatestRevisionDate: 17-Jul-2002; LatestRevisionNote: Re-released for DXP Platform.; PackageReference: RAD-0.3; Publisher: Altium Limited; PackageDescription: Radial Cap, Thru-Hole; 2 Leads; 0.3 in Pin Spacing

## Nets that join several sheets
3V3: POWER (C11#1.1 C12.2 R17.2 U5.5), JTAG (P1.1), NRF24L01 (P3.2), LED BELL (R6#2.2), MPU6050 (6 pins), STM32F103RC (7 pins), HMC5883 (R1#2.1 U1#2.2 U1#2.4 U1#2.13), MS5611 (C3#2.2 U2.1 U2.2)
3V7: POWER (7 pins), MOTORS (M1.1 M2.1 M3.1 M4.1)
GND: POWER (20 pins), JTAG (P1.4), NRF24L01 (P3.1), MOTORS (8 pins), LED BELL (D1.2 D2.2 D3.2 D4.2), MPU6050 (7 pins), STM32F103RC (13 pins), HMC5883 (C2#2.1 U1#2.9 U1#2.11), MS5611 (C3#2.1 U2.3 U2.4 U2.5)
BAT_CHECK: POWER (C10#1.2 R15.1 R16.2), STM32F103RC (U7.18)
GPIO_BELL: LED BELL (LS1.2), STM32F103RC (U7.20)
GPIO_LED0: LED BELL (R2#1.2), STM32F103RC (U7.29)
GPIO_LED1: LED BELL (R3#1.2), STM32F103RC (U7.32)
GPIO_LED2: LED BELL (R4#1.2), STM32F103RC (U7.19)
GPIO_LED3: LED BELL (R5#2.2), STM32F103RC (U7.39)
HMC5883_IRQ: STM32F103RC (U7.40), HMC5883 (R1#2.2 U1#2.15)
MPU6050_IRQ: MPU6050 (R20.2 U6.12), STM32F103RC (U7.41)
NRF24L01_CE: NRF24L01 (P3.3), STM32F103RC (U7.33)
NRF24L01_CSN: NRF24L01 (P3.4), STM32F103RC (U7.14)
NRF24L01_IRQ: NRF24L01 (P3.8), STM32F103RC (U7.38)
RESET: JTAG (P1.5), STM32F103RC (C16.1 R21.1 RST1.1 U7.7)
SWCLK: JTAG (P1.3), STM32F103RC (U7.37)
SWDIO: JTAG (P1.2), STM32F103RC (U7.34)
UART1_RX: UART (P2.1), STM32F103RC (U7.31)
UART1_TX: UART (P2.2), STM32F103RC (U7.30)